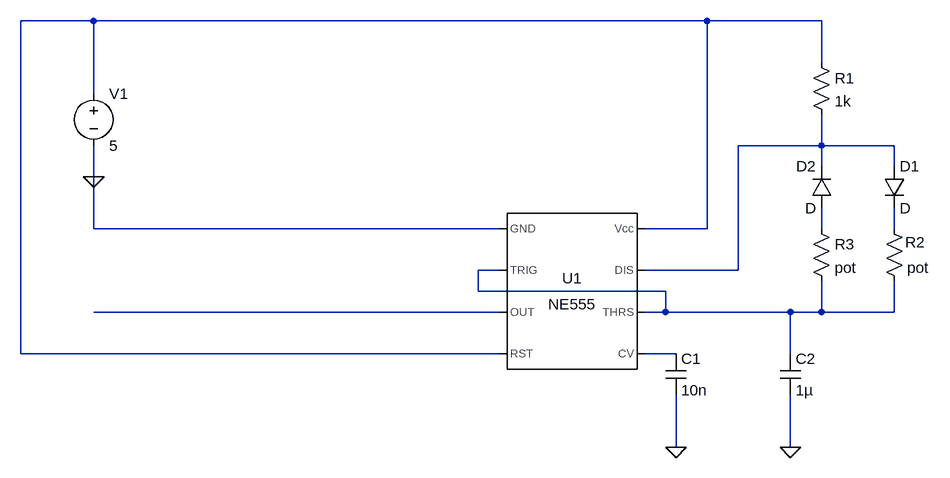
[diagram p0: schematic ex7.asc]
ex7.asc, the LTspice schematic file:
Version 4
SHEET 1 1140 680
WIRE -576 -272 -688 -272
WIRE 368 -272 -576 -272
WIRE 544 -272 368 -272
WIRE 544 -208 544 -272
WIRE -576 -160 -576 -272
WIRE 544 -80 544 -128
WIRE 544 -80 416 -80
WIRE 656 -80 544 -80
WIRE 544 -48 544 -80
WIRE 656 -48 656 -80
WIRE -576 -32 -576 -80
WIRE -576 48 -576 -32
WIRE 48 48 -576 48
WIRE 368 48 368 -272
WIRE 368 48 272 48
WIRE 544 48 544 16
WIRE 656 48 656 16
WIRE 48 112 16 112
WIRE 416 112 416 -80
WIRE 416 112 272 112
WIRE 16 144 16 112
WIRE 304 144 16 144
WIRE 48 176 -576 176
WIRE 304 176 304 144
WIRE 304 176 272 176
WIRE 496 176 304 176
WIRE 544 176 544 128
WIRE 544 176 496 176
WIRE 656 176 656 128
WIRE 656 176 544 176
WIRE -688 240 -688 -272
WIRE 48 240 -688 240
WIRE 320 240 272 240
WIRE 496 240 496 176
WIRE 320 384 320 304
WIRE 496 384 496 304
FLAG -576 -32 0
FLAG 320 384 0
FLAG 496 384 0
SYMBOL voltage -576 -176 R0
WINDOW 123 0 0 Left 2
WINDOW 39 0 0 Left 2
SYMATTR InstName V1
SYMATTR Value 5
SYMBOL Misc\\NE555 160 144 R0
SYMATTR InstName U1
SYMBOL cap 304 240 R0
SYMATTR InstName C1
SYMATTR Value 10n
SYMBOL res 528 -224 R0
SYMATTR InstName R1
SYMATTR Value 1k
SYMBOL cap 480 240 R0
SYMATTR InstName C2
SYMATTR Value 1µ
SYMBOL res 640 32 R0
WINDOW 0 33 37 Left 2
SYMATTR InstName R2
SYMATTR Value pot
SYMBOL diode 640 -48 R0
SYMATTR InstName D1
SYMBOL diode 560 16 R180
WINDOW 0 24 64 Left 2
WINDOW 3 24 0 Left 2
SYMATTR InstName D2
SYMBOL res 528 32 R0
SYMATTR InstName R3
SYMATTR Value pot

The netlist it stands for:
* ex7.asc
V1 N001 0 5
XU1 0 N005 N006 N001 N007 N005 N002 N001 NE555  ; pins GND TRIG OUT RST CV THRS DIS Vcc
C1 N007 0 10n
R1 N001 N002 1k
C2 N005 0 1µ
R2 N004 N005 pot
D1 N002 N004 D
D2 N003 N002 D
R3 N003 N005 pot
.model D D
.lib standard.dio
.lib NE555.sub
.backanno
.end